# Altium project PCB_Project.PrjPcb
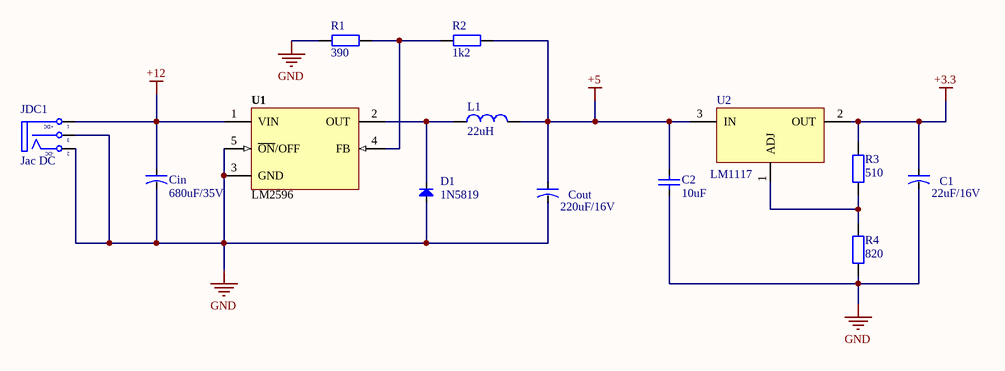
[diagram p0: Power.SchDoc]
1 sheet, 13 parts. Net scope: global (net labels, ports and power ports of the same name join across sheets).
Board file: Power.PcbDoc

## Sheet Power.SchDoc
size A

### Parts
C1  22uF/16V  [CA-ALU-4]
C2  10uF  [CAP_0805]
Cin  680uF/35V  [CA-ALU-10]
Cout  220uF/16V  [CA-ALU-6.3]
D1  1N5819  [SMA]
JDC1  Jac DC  [DC-IN]
L1  22uH  [L-SMD-M-12x10]
R1  390  [RES-SMD-0805]
R2  1k2  [RES-SMD-0805]
R3  510  [RES-SMD-0805]
R4  820  [RES-SMD-0805]
U1  LM2596  [TO-263]
U2  LM1117  [LM1117-SOP]

### Nets
+3.3: C1.1 R3.1 U2.2(OUT)
+5: C2.2 Cout.1 L1.2 R2.1 U2.3(IN)
+12: Cin.1 JDC1.1(T) U1.1(VIN)
GND: C1.2 C2.1 Cin.2 Cout.2 D1.1(A) JDC1.2(TN) JDC1.3(S) R1.2 R4.2 U1.3(GND) U1.5(~{ON}/OFF)
NetD1_2: D1.2(K) L1.1 U1.2(OUT)
NetR1_1: R1.1 R2.2 U1.4(FB)
NetR3_2: R3.2 R4.1 U2.1(ADJ)

### Notes on the sheet
- (in symbol DCIN) +DC; -DC

### Library data of the parts
C1 Cin Cout = CAP-ALU-DIP: Capacitor (Semiconductor SIM Model); Value: 104; LatestRevisionDate: 17-Jul-2002; LatestRevisionNote: Re-released for DXP Platform.; PackageReference: C1206; Publisher: Altium Limited
C2 = CapSMD: Capacitor; Value: 33p; Published: 8-Jun-2000; LatestRevisionDate: 17-Jul-2002; LatestRevisionNote: Re-released for DXP Platform.; PackageReference: RAD-0.3; Publisher: Altium Limited
D1 = Diode: Default Diode; Code - JEDEC: DO-214-AB; Value: 1N5007; Published: 8-Jun-2000; Revision: July-2002: Re-released for DXP Platform.; Publisher: Altium Limited
JDC1 = DCIN: Jac DC input; Value: Jac DC
L1 = Inductor: Value: 150 mH
R1-R4 = Resistor - SMD: Resistor SMD; Manufacturer: Generic Components; Class: Passive; Published: 08/06/2000; Publisher: Altium Hobart Technology Centre
U1 = LM2596: Max Input Voltage: 12 V; Max Output Current: 3 (6.0 peak) A; Max Output Voltage: mV; Category: IC-Power; Min Input Voltage: mV; Min Output Voltage: mV; Mounting Technology: Surface Mount; Status: Unreleased; Supply Voltage: mV; Temperature Range: -40 to +125 degC
U2 = LM1117-ADJ: 800mA Low-Dropout Linear Regulator; Creator: Nguyen Ba Bien; Website: http://group3i.net